# EAGLE design ww-impedance-matching (EAGLE 9.6.1)
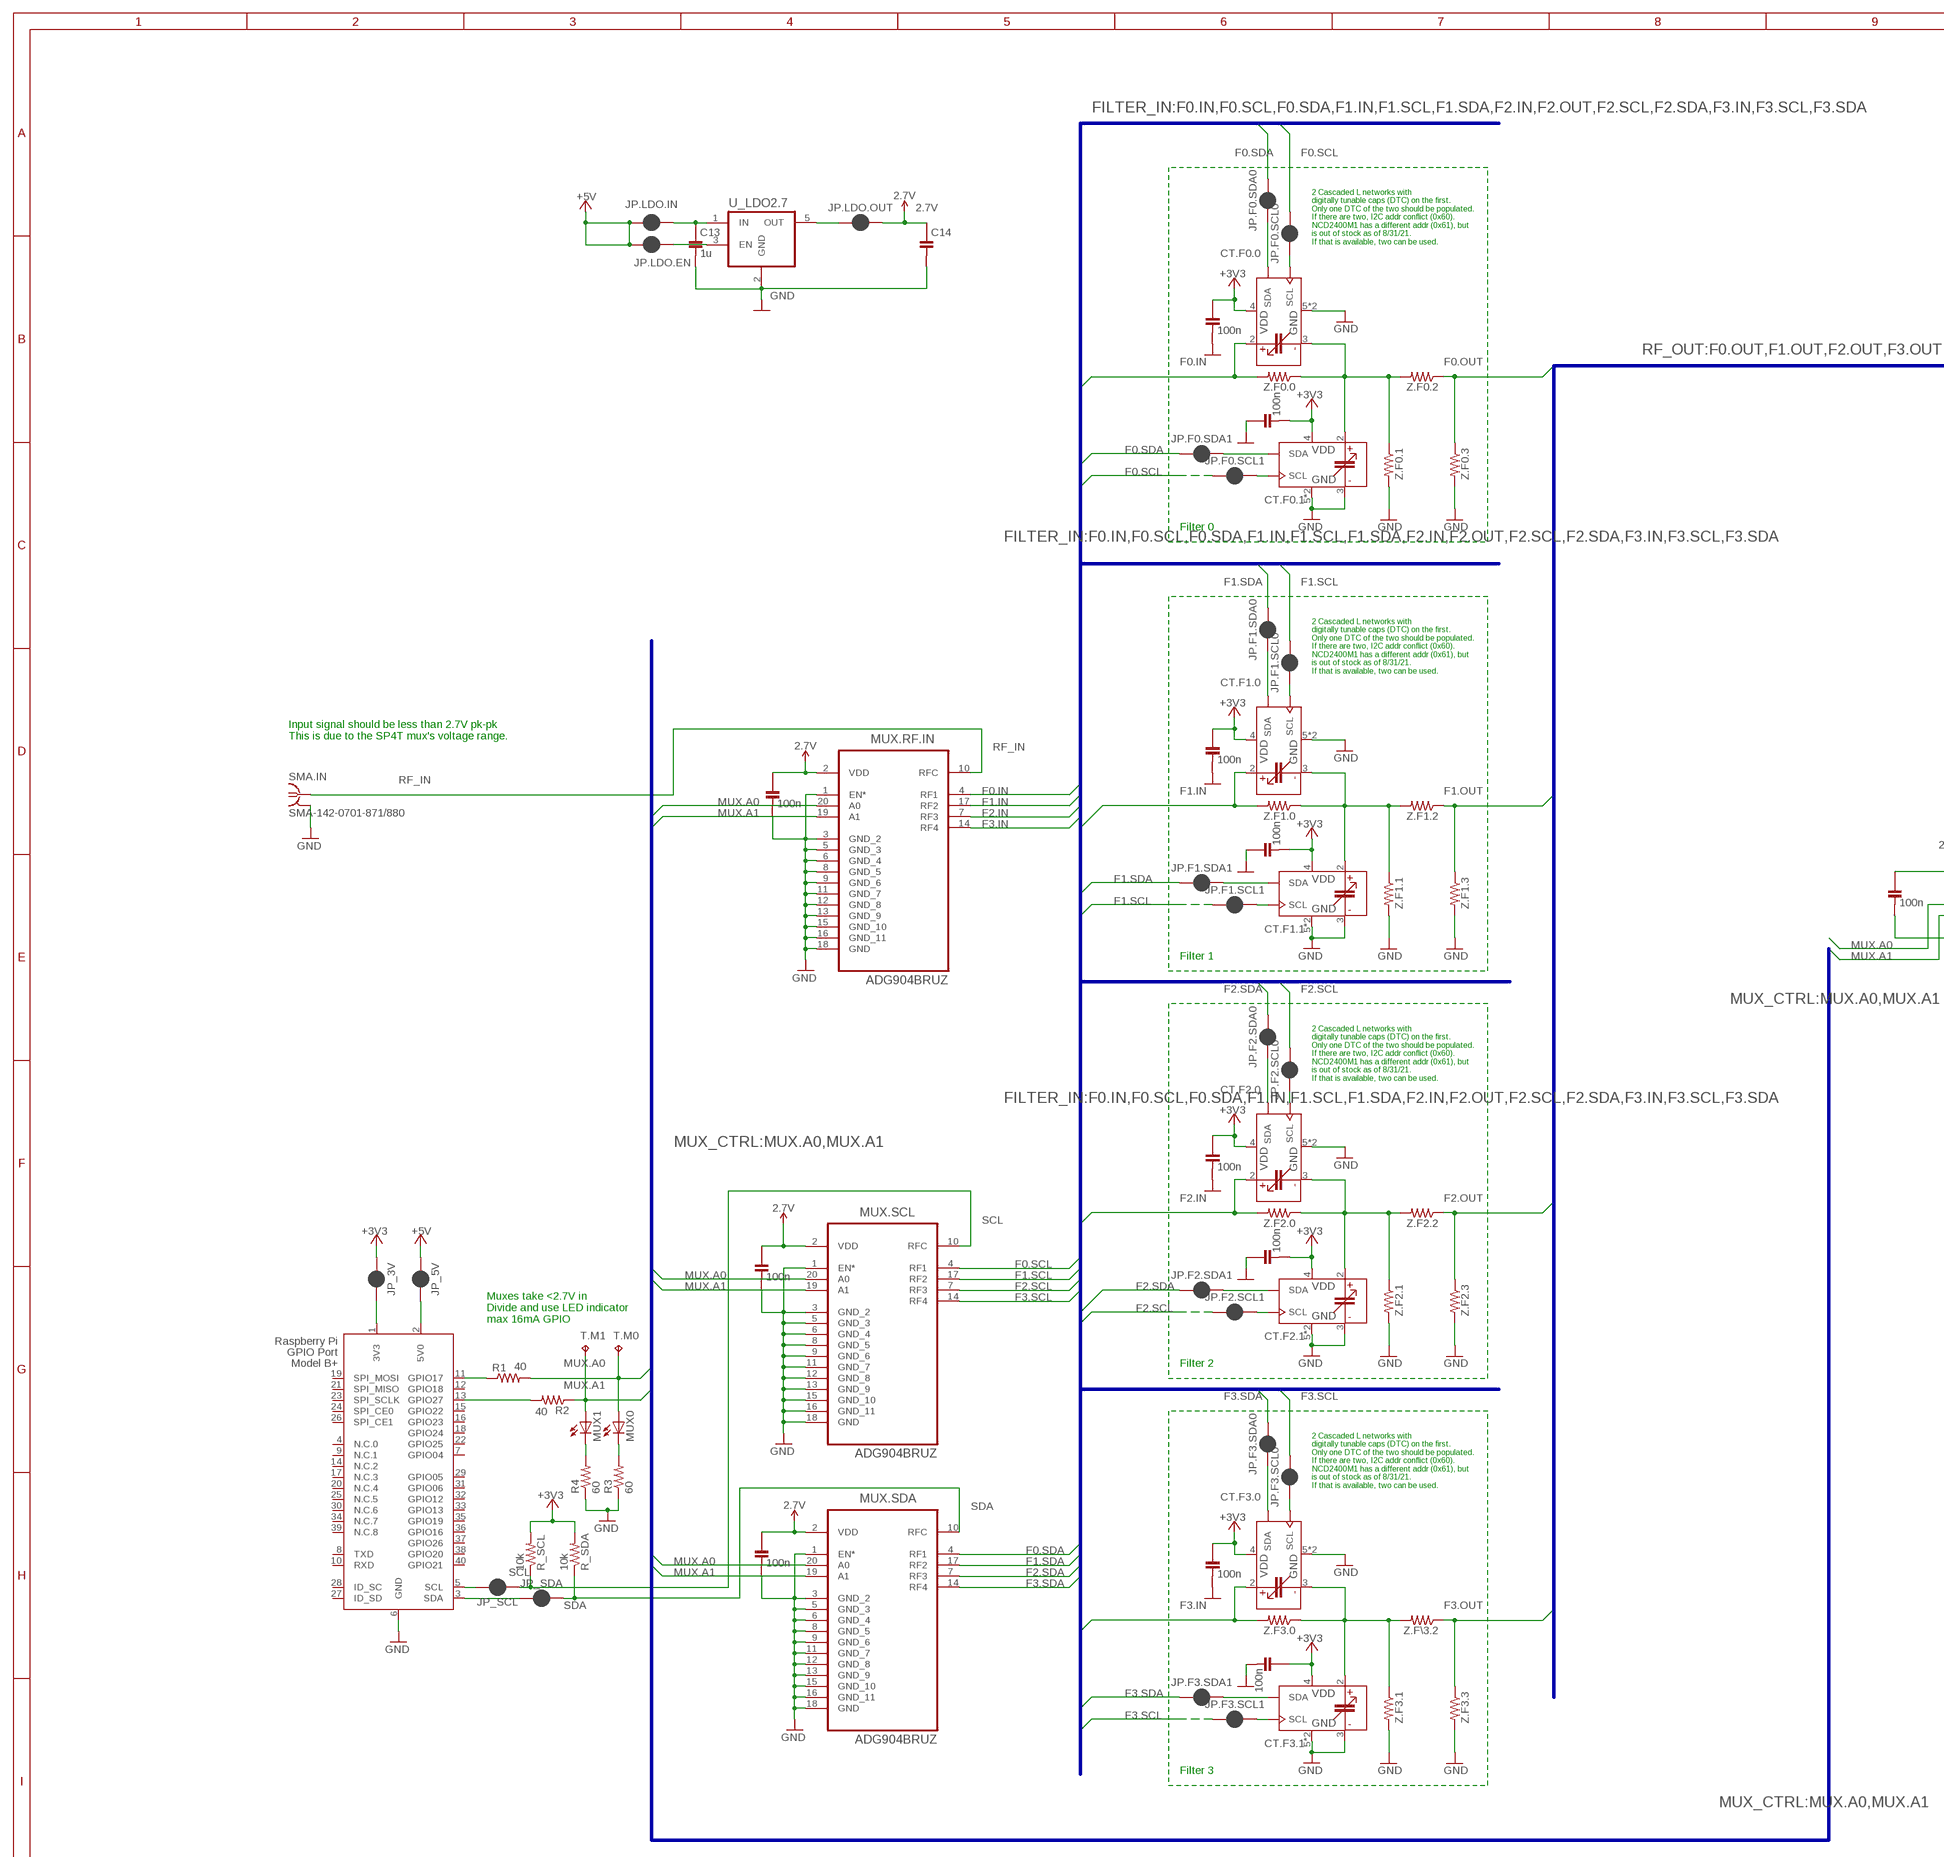
[diagram p0: schematic, sheet 1, part 1 of 2]
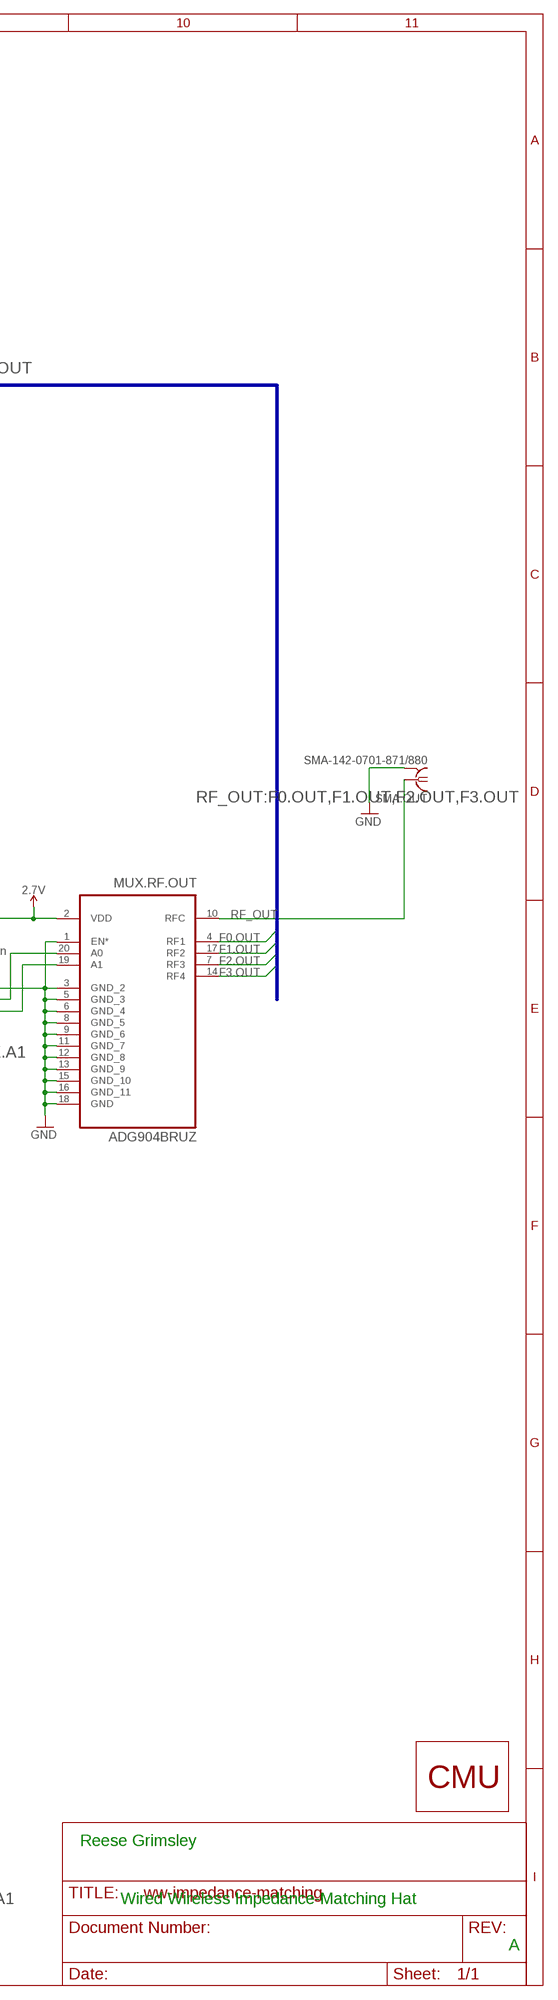
[diagram p1: schematic, sheet 1, part 2 of 2]

## Parts
C1  100n  C-0603  [C0603]
C2  100n  C-0603  [C0603]
C3  100n  C-0603  [C0603]
C4  100n  C-0603  [C0603]
C5  100n  C-0603  [C0603]
C6  100n  C-0603  [C0603]
C7  100n  C-0603  [C0603]
C8  100n  C-0603  [C0603]
C9  100n  C-0603  [C0603]
C10  100n  C-0603  [C0603]
C11  100n  C-0603  [C0603]
C12  100n  C-0603  [C0603]
C13  1u  C-0603  [C0603]
C14  C-0805  [C0805]
CT.F0.0  TUNABLE_CAP_NCD2400MTR  [DFN-6_NCD2400M]
CT.F0.1  TUNABLE_CAP_NCD2400MTR  [DFN-6_NCD2400M]
CT.F1.0  TUNABLE_CAP_NCD2400MTR  [DFN-6_NCD2400M]
CT.F1.1  TUNABLE_CAP_NCD2400MTR  [DFN-6_NCD2400M]
CT.F2.0  TUNABLE_CAP_NCD2400MTR  [DFN-6_NCD2400M]
CT.F2.1  TUNABLE_CAP_NCD2400MTR  [DFN-6_NCD2400M]
CT.F3.0  TUNABLE_CAP_NCD2400MTR  [DFN-6_NCD2400M]
CT.F3.1  TUNABLE_CAP_NCD2400MTR  [DFN-6_NCD2400M]
JP.F0.SCL0  JUMPER-SMT_2_NC_PASTE_NO-SILK  [SMT-JUMPER_2_NC_PASTE_NO-SILK]
JP.F0.SCL1  JUMPER-SMT_2_NC_PASTE_NO-SILK  [SMT-JUMPER_2_NC_PASTE_NO-SILK]
JP.F0.SDA0  JUMPER-SMT_2_NC_PASTE_NO-SILK  [SMT-JUMPER_2_NC_PASTE_NO-SILK]
JP.F0.SDA1  JUMPER-SMT_2_NC_PASTE_NO-SILK  [SMT-JUMPER_2_NC_PASTE_NO-SILK]
JP.F1.SCL0  JUMPER-SMT_2_NC_PASTE_NO-SILK  [SMT-JUMPER_2_NC_PASTE_NO-SILK]
JP.F1.SCL1  JUMPER-SMT_2_NC_PASTE_NO-SILK  [SMT-JUMPER_2_NC_PASTE_NO-SILK]
JP.F1.SDA0  JUMPER-SMT_2_NC_PASTE_NO-SILK  [SMT-JUMPER_2_NC_PASTE_NO-SILK]
JP.F1.SDA1  JUMPER-SMT_2_NC_PASTE_NO-SILK  [SMT-JUMPER_2_NC_PASTE_NO-SILK]
JP.F2.SCL0  JUMPER-SMT_2_NC_PASTE_NO-SILK  [SMT-JUMPER_2_NC_PASTE_NO-SILK]
JP.F2.SCL1  JUMPER-SMT_2_NC_PASTE_NO-SILK  [SMT-JUMPER_2_NC_PASTE_NO-SILK]
JP.F2.SDA0  JUMPER-SMT_2_NC_PASTE_NO-SILK  [SMT-JUMPER_2_NC_PASTE_NO-SILK]
JP.F2.SDA1  JUMPER-SMT_2_NC_PASTE_NO-SILK  [SMT-JUMPER_2_NC_PASTE_NO-SILK]
JP.F3.SCL0  JUMPER-SMT_2_NC_PASTE_NO-SILK  [SMT-JUMPER_2_NC_PASTE_NO-SILK]
JP.F3.SCL1  JUMPER-SMT_2_NC_PASTE_NO-SILK  [SMT-JUMPER_2_NC_PASTE_NO-SILK]
JP.F3.SDA0  JUMPER-SMT_2_NC_PASTE_NO-SILK  [SMT-JUMPER_2_NC_PASTE_NO-SILK]
JP.F3.SDA1  JUMPER-SMT_2_NC_PASTE_NO-SILK  [SMT-JUMPER_2_NC_PASTE_NO-SILK]
JP.LDO.EN  JUMPER-SMT_2_NC_PASTE_NO-SILK  [SMT-JUMPER_2_NC_PASTE_NO-SILK]
JP.LDO.IN  JUMPER-SMT_2_NC_PASTE_NO-SILK  [SMT-JUMPER_2_NC_PASTE_NO-SILK]
JP.LDO.OUT  JUMPER-SMT_2_NC_PASTE_NO-SILK  [SMT-JUMPER_2_NC_PASTE_NO-SILK]
JP_3V  JUMPER-SMT_2_NC_PASTE_NO-SILK  [SMT-JUMPER_2_NC_PASTE_NO-SILK]
JP_5V  JUMPER-SMT_2_NC_PASTE_NO-SILK  [SMT-JUMPER_2_NC_PASTE_NO-SILK]
JP_SCL  JUMPER-SMT_2_NC_PASTE_NO-SILK  [SMT-JUMPER_2_NC_PASTE_NO-SILK]
JP_SDA  JUMPER-SMT_2_NC_PASTE_NO-SILK  [SMT-JUMPER_2_NC_PASTE_NO-SILK]
LOGO1  LOGO-CMU  [CMU_LOGO]
MUX0  LEDCHIPLED_0603  [CHIPLED_0603]
MUX1  LEDCHIPLED_0603  [CHIPLED_0603]
MUX.RF.IN  ADG904BRUZ  [SOP65P640X120-20N]
MUX.RF.OUT  ADG904BRUZ  [SOP65P640X120-20N]
MUX.SCL  ADG904BRUZ  [SOP65P640X120-20N]
MUX.SDA  ADG904BRUZ  [SOP65P640X120-20N]
R1  40  R-0603  [R0603]
R2  40  R-0603  [R0603]
R3  60  R-0603  [R0603]
R4  60  R-0603  [R0603]
R_SCL  10k  R-0603  [R0603]
R_SDA  10k  R-0603  [R0603]
SMA.IN  SMA-142-0701-871/880  [SMA-142-0701-871]
SMA.OUT  SMA-142-0701-871/880  [SMA-142-0701-871]
T.M0  TPTP14R  [TP14R]
T.M1  TPTP14R  [TP14R]
U_LDO2.7  TPS76327DBVT  [SOT95P280X145-5N]
X1  RASPI_BOARD_B+_E4P  [RASPI_BOARD_B+_EDGES_4DRILL_PAD]
Z.F0.0  R-0603  [R0603]
Z.F0.1  R-0603  [R0603]
Z.F0.2  R-0603  [R0603]
Z.F0.3  R-0603  [R0603]
Z.F1.0  R-0603  [R0603]
Z.F1.1  R-0603  [R0603]
Z.F1.2  R-0603  [R0603]
Z.F1.3  R-0603  [R0603]
Z.F2.0  R-0603  [R0603]
Z.F2.1  R-0603  [R0603]
Z.F2.2  R-0603  [R0603]
Z.F2.3  R-0603  [R0603]
Z.F3.0  R-0603  [R0603]
Z.F3.1  R-0603  [R0603]
Z.F3.3  R-0603  [R0603]
Z.F\3.2  R-0603  [R0603]

## Nets
2.7V [PWR]: C7.1 C9.1 C11.1 C12.1 C14.1 JP.LDO.OUT.1 MUX.RF.IN.2(VDD) MUX.RF.OUT.2(VDD) MUX.SCL.2(VDD) MUX.SDA.2(VDD)
3V3.JMP [PWR]: JP_3V.1 X1.1(3V3)
5V.JMP [PWR]: JP_5V.1 X1.2(5V0)
+3V3 [PWR]: C1.1 C2.2 C3.1 C4.1 C5.1 C6.2 C8.1 C10.2 CT.F0.0.4(VDD) CT.F0.1.4(VDD) CT.F1.0.4(VDD) CT.F1.1.4(VDD) CT.F2.0.4(VDD) CT.F2.1.4(VDD) CT.F3.0.4(VDD) CT.F3.1.4(VDD) JP_3V.2 R_SCL.2 R_SDA.2
+5V [PWR]: JP.LDO.EN.2 JP.LDO.IN.2 JP_5V.2
F0.IN [RF]: CT.F0.0.2(C+) MUX.RF.IN.4(RF1) Z.F0.0.2
F0.OUT [RF]: MUX.RF.OUT.4(RF1) Z.F0.2.1 Z.F0.3.1
F0.SCL: JP.F0.SCL0.1 JP.F0.SCL1.2 MUX.SCL.4(RF1)
F0.SDA: JP.F0.SDA0.1 JP.F0.SDA1.2 MUX.SDA.4(RF1)
F0SCL0: CT.F0.0.6(SCL) JP.F0.SCL0.2
F0SCL1: CT.F0.1.6(SCL) JP.F0.SCL1.1
F0SDA0: CT.F0.0.1(SDA) JP.F0.SDA0.2
F0SDA1: CT.F0.1.1(SDA) JP.F0.SDA1.1
F1.IN [RF]: CT.F1.0.2(C+) MUX.RF.IN.17(RF2) Z.F1.0.2
F1.OUT [RF]: MUX.RF.OUT.17(RF2) Z.F1.2.1 Z.F1.3.1
F1.SCL: JP.F1.SCL0.1 JP.F1.SCL1.2 MUX.SCL.17(RF2)
F1.SDA: JP.F1.SDA0.1 JP.F1.SDA1.2 MUX.SDA.17(RF2)
F1SCL0: CT.F1.0.6(SCL) JP.F1.SCL0.2
F1SCL1: CT.F1.1.6(SCL) JP.F1.SCL1.1
F1SDA0: CT.F1.0.1(SDA) JP.F1.SDA0.2
F1SDA1: CT.F1.1.1(SDA) JP.F1.SDA1.1
F2.IN [RF]: CT.F2.0.2(C+) MUX.RF.IN.7(RF3) Z.F2.0.2
F2.OUT [RF]: MUX.RF.OUT.7(RF3) Z.F2.2.1 Z.F2.3.1
F2.SCL: JP.F2.SCL0.1 JP.F2.SCL1.2 MUX.SCL.7(RF3)
F2.SDA: JP.F2.SDA0.1 JP.F2.SDA1.2 MUX.SDA.7(RF3)
F2SCL0: CT.F2.0.6(SCL) JP.F2.SCL0.2
F2SCL1: CT.F2.1.6(SCL) JP.F2.SCL1.1
F2SDA0: CT.F2.0.1(SDA) JP.F2.SDA0.2
F2SDA1: CT.F2.1.1(SDA) JP.F2.SDA1.1
F3.IN [RF]: CT.F3.0.2(C+) MUX.RF.IN.14(RF4) Z.F3.0.2
F3.OUT [RF]: MUX.RF.OUT.14(RF4) Z.F3.3.1 Z.F\3.2.1
F3.SCL: JP.F3.SCL0.1 JP.F3.SCL1.2 MUX.SCL.14(RF4)
F3.SDA: JP.F3.SDA0.1 JP.F3.SDA1.2 MUX.SDA.14(RF4)
F3SCL0: CT.F3.0.6(SCL) JP.F3.SCL0.2
F3SCL1: CT.F3.1.6(SCL) JP.F3.SCL1.1
F3SDA0: CT.F3.0.1(SDA) JP.F3.SDA0.2
F3SDA1: CT.F3.1.1(SDA) JP.F3.SDA1.1
GND: C1.2 C2.1 C3.2 C4.2 C5.2 C6.1 C7.2 C8.2 C9.2 C10.1 C11.2 C12.2 C13.2 C14.2 CT.F0.0.5(GND) CT.F0.0.7(GND) CT.F0.1.3(C-) CT.F0.1.5(GND) CT.F0.1.7(GND) CT.F1.0.5(GND) CT.F1.0.7(GND) CT.F1.1.3(C-) CT.F1.1.5(GND) CT.F1.1.7(GND) CT.F2.0.5(GND) CT.F2.0.7(GND) CT.F2.1.3(C-) CT.F2.1.5(GND) CT.F2.1.7(GND) CT.F3.0.5(GND) CT.F3.0.7(GND) CT.F3.1.3(C-) CT.F3.1.5(GND) CT.F3.1.7(GND) MUX.RF.IN.1(EN*) MUX.RF.IN.3(GND_2) MUX.RF.IN.5(GND_3) MUX.RF.IN.6(GND_4) MUX.RF.IN.8(GND_5) MUX.RF.IN.9(GND_6) MUX.RF.IN.11(GND_7) MUX.RF.IN.12(GND_8) MUX.RF.IN.13(GND_9) MUX.RF.IN.15(GND_10) MUX.RF.IN.16(GND_11) MUX.RF.IN.18(GND) MUX.RF.OUT.1(EN*) MUX.RF.OUT.3(GND_2) MUX.RF.OUT.5(GND_3) MUX.RF.OUT.6(GND_4) MUX.RF.OUT.8(GND_5) MUX.RF.OUT.9(GND_6) MUX.RF.OUT.11(GND_7) MUX.RF.OUT.12(GND_8) MUX.RF.OUT.13(GND_9) MUX.RF.OUT.15(GND_10) MUX.RF.OUT.16(GND_11) MUX.RF.OUT.18(GND) MUX.SCL.1(EN*) MUX.SCL.3(GND_2) MUX.SCL.5(GND_3) MUX.SCL.6(GND_4) MUX.SCL.8(GND_5) MUX.SCL.9(GND_6) MUX.SCL.11(GND_7) MUX.SCL.12(GND_8) MUX.SCL.13(GND_9) MUX.SCL.15(GND_10) MUX.SCL.16(GND_11) MUX.SCL.18(GND) MUX.SDA.1(EN*) MUX.SDA.3(GND_2) MUX.SDA.5(GND_3) MUX.SDA.6(GND_4) MUX.SDA.8(GND_5) MUX.SDA.9(GND_6) MUX.SDA.11(GND_7) MUX.SDA.12(GND_8) MUX.SDA.13(GND_9) MUX.SDA.15(GND_10) MUX.SDA.16(GND_11) MUX.SDA.18(GND) R3.1 R4.1 SMA.IN.2@1 SMA.IN.2@2 SMA.IN.2@3 SMA.IN.2@4 SMA.OUT.2@1 SMA.OUT.2@2 SMA.OUT.2@3 SMA.OUT.2@4 U_LDO2.7.2(GND) X1.6(GND) Z.F0.1.2 Z.F0.3.2 Z.F1.1.2 Z.F1.3.2 Z.F2.1.2 Z.F2.3.2 Z.F3.1.2 Z.F3.3.2
LDO.IN: C13.1 JP.LDO.IN.1 U_LDO2.7.1(IN)
LDO.OUT [PWR]: JP.LDO.OUT.2 U_LDO2.7.5(OUT)
MUX.A0: MUX0.A MUX.RF.IN.20(A0) MUX.RF.OUT.20(A0) MUX.SCL.20(A0) MUX.SDA.20(A0) R1.2 T.M0.TP
MUX.A1: MUX1.A MUX.RF.IN.19(A1) MUX.RF.OUT.19(A1) MUX.SCL.19(A1) MUX.SDA.19(A1) R2.1 T.M1.TP
N$6: MUX1.C R4.2
N$9: JP.LDO.EN.1 U_LDO2.7.3(EN)
N$10: MUX0.C R3.2
N$11: R2.2 X1.13(GPIO27)
N$12: R1.1 X1.11(GPIO17)
RF.F0.0 [RF]: CT.F0.0.3(C-) CT.F0.1.2(C+) Z.F0.0.1 Z.F0.1.1 Z.F0.2.2
RF.F1.0 [RF]: CT.F1.0.3(C-) CT.F1.1.2(C+) Z.F1.0.1 Z.F1.1.1 Z.F1.2.2
RF.F2.0 [RF]: CT.F2.0.3(C-) CT.F2.1.2(C+) Z.F2.0.1 Z.F2.1.1 Z.F2.2.2
RF.F3.0 [RF]: CT.F3.0.3(C-) CT.F3.1.2(C+) Z.F3.0.1 Z.F3.1.1 Z.F\3.2.2
RF_IN [RF]: MUX.RF.IN.10(RFC) SMA.IN.1
RF_OUT [RF]: MUX.RF.OUT.10(RFC) SMA.OUT.1
SCL: JP_SCL.2 MUX.SCL.10(RFC) R_SCL.1
SCL.IN: JP_SCL.1 X1.5(SCL)
SDA: JP_SDA.1 MUX.SDA.10(RFC) R_SDA.1
SDA.IN: JP_SDA.2 X1.3(SDA)
Unconnected: X1.4(N.C.0) X1.7(GPIO04) X1.8(TXD) X1.9(N.C.1) X1.10(RXD) X1.12(GPIO18) X1.14(N.C.2) X1.15(GPIO22) X1.16(GPIO23) X1.17(N.C.3) X1.18(GPIO24) X1.19(SPI_MOSI) X1.20(N.C.4) X1.21(SPI_MISO) X1.22(GPIO25) X1.23(SPI_SCLK) X1.24(SPI_CE0) X1.25(N.C.5) X1.26(SPI_CE1) X1.27(ID_SD) X1.28(ID_SC) X1.29(GPIO05) X1.30(N.C.6) X1.31(GPIO06) X1.32(GPIO12) X1.33(GPIO13) X1.34(N.C.7) X1.35(GPIO19) X1.36(GPIO16) X1.37(GPIO26) X1.38(GPIO20) X1.39(N.C.8) X1.40(GPIO21)

## Buses
FILTER_IN:F0.IN,F0.SCL,F0.SDA,F1.IN,F1.SCL,F1.SDA,F2.IN,F2.OUT,F2.SCL,F2.SDA,F3.IN,F3.SCL,F3.SDA
MUX_CTRL:MUX.A0,MUX.A1
RF_OUT:F0.OUT,F1.OUT,F2.OUT,F3.OUT

## Notes on the sheet
- 2 Cascaded L networks with 
  digitally tunable caps (DTC) on the first. 
  Only one DTC of the two should be populated. 
  If there are two, I2C addr conflict (0x60).
  NCD2400M1 has a different addr (0x61), but
  is out of stock as of 8/31/21. 
  If that is available, two can be used.
- Filter 0
- 2 Cascaded L networks with 
  digitally tunable caps (DTC) on the first. 
  Only one DTC of the two should be populated. 
  If there are two, I2C addr conflict (0x60).
  NCD2400M1 has a different addr (0x61), but
  is out of stock as of 8/31/21. 
  If that is available, two can be used.
- Input signal should be less than 2.7V pk-pk
  This is due to the SP4T mux's voltage range.
- Filter 1
- 2 Cascaded L networks with 
  digitally tunable caps (DTC) on the first. 
  Only one DTC of the two should be populated. 
  If there are two, I2C addr conflict (0x60).
  NCD2400M1 has a different addr (0x61), but
  is out of stock as of 8/31/21. 
  If that is available, two can be used.
- Muxes take <2.7V in
  Divide and use LED indicator
  max 16mA GPIO
- Filter 2
- 2 Cascaded L networks with 
  digitally tunable caps (DTC) on the first. 
  Only one DTC of the two should be populated. 
  If there are two, I2C addr conflict (0x60).
  NCD2400M1 has a different addr (0x61), but
  is out of stock as of 8/31/21. 
  If that is available, two can be used.
- Reese Grimsley
- Filter 3
- Wired Wireless Impedance-Matching Hat
- A

## Library data of the parts
C1-C12 = Capacitors:C-: Capacitor, Surface Mount; MANUFACTURER: YAGEO; MP: CC0603MRX7R7BB104; MPN: CC0603MRX7R7BB104; PART_NO: CC0603MRX7R7BB104; TC: X7R; TOL: 10%; VOLTAGE: 6.3V
C13 = Capacitors:C-: Capacitor, Surface Mount; MANUFACTURER: Kemet; MP: CC0603MRX5R8BB105; MPN: CC0603MRX5R8BB105; PART_NO: CC0603MRX5R8BB105; TC: X7R; TOL: 10%; VOLTAGE: 6.3V
C14 = Capacitors:C-: Capacitor, Surface Mount; MANUFACTURER: Kemet; MP: CC0805KPX5R6BB106; MPN: CC0805KPX5R6BB106; PART_NO: CC0805KPX5R6BB106; TC: X7R; TOL: 10%; VOLTAGE: 6.3V
CT.F0.0 CT.F0.1 CT.F1.0 CT.F1.1 CT.F2.0 CT.F2.1 CT.F3.0 CT.F3.1 = Capacitors:TUNABLE_CAP_NCD2400MTR: Digitally Tunable Capacitor NCD2400M from IXYS; MP: NCD2400M; MPN: NCD2400M; PART_NO: NCD2400M
JP.F0.SCL0 JP.F0.SCL1 JP.F0.SDA0 JP.F0.SDA1 JP.F1.SCL0 JP.F1.SCL1 JP.F1.SDA0 JP.F1.SDA1 JP.F2.SCL0 JP.F2.SCL1 JP.F2.SDA0 JP.F2.SDA1 JP.F3.SCL0 JP.F3.SCL1 JP.F3.SDA0 JP.F3.SDA1 JP.LDO.EN JP.LDO.IN JP.LDO.OUT JP_3V JP_5V JP_SCL JP_SDA = Connectors:JUMPER-SMT_2_NC_PASTE: Normally closed solder jumper This jumper has an aperture in the stencil to allow solder paste to bridge the split in the wire so it's normally closed (NC). Wick off the solder to open the connection. Reapply solder to reclose the connection.; BOM: EXCLUDE
LOGO1 = Graphics:LOGO-CMU: CMU silkscreen logo
MUX0 MUX1 = Diodes:LED: LED OSRAM: - CHIPLED LG R971, LG N971, LY N971, LG Q971, LY Q971, LO R971, LY R971 LH N974, LH R974 LS Q976, LO Q976, LY Q976 LO Q996 - Hyper CHIPLED LW Q18S LB Q993, LB Q99A, LB R99A - SideLED LS A670, LO A670, LY A670, LG A670, LP A670 LB A673, LV A673, LT A673, LW A673 LH A674 LY A675 LS A676, LA A676, LO A676, LY A676, LW A676 LS A679, LY A679, LG A679 - Hyper Micro SIDELED® LS Y876, LA Y876, LO Y876, LY Y876 LT Y87S - SmartLED LW L88C, LW L88S LB L89C, LB L89S, LG L890 LS L89K, LO L89K, LY L89K LS L896, LA L896, LO L896, LY L896 - TOPLED LS T670, LO T670, LY T670, LG T670, LP T670 LSG T670, LSP T670, LSY T670, LOP T670, LYG T670 LG T671, LOG T671, LSG T671 LB T673, LV T673, LT T673, LW T673 LH T674 LS T676, LA T676, LO T676, LY T676, LB T676, LH T676, LSB T676, LW T676 LB T67C, LV T67C, LT T67C, LS T67K, LO T67K, LY T67K, LW E67C LS E67B, LA E67B, LO E67B, LY E67B, LB E67C, LV E67C, LT E67C LW T67C LS T679, LY T679, LG T679 LS T770, LO T770, LY T770, LG T770, LP T770 LB T773, LV T773, LT T773, LW T773 LH T774 LS E675, LA E675, LY E675, LS T675 LS T776, LA T776, LO T776, LY T776, LB T776 LHGB T686 LT T68C, LB T68C - Hyper Mini TOPLED® LB M676 - Mini TOPLED Santana® LG M470 LS M47K, LO M47K, LY M47K Source: http://www.osram.convergy.de/; MP: LSM0603412V; MPN: LSM0603412V; PART_NO: LSM0603412V
MUX.RF.IN MUX.RF.OUT MUX.SCL MUX.SDA = Switches:ADG904BRUZ: Analog MULTIPLEXER, 4X1, 20TSSOP Check prices <https://pricing.snapeda.com/parts/ADG904BRUZ/Analog%20Devices/view-part?ref=eda>; AVAILABILITY: In Stock; DESCRIPTION: 1 Circuit IC Switch 4:1 20-TSSOP; MF: Analog Devices; MP: ADG904BRUZ; PACKAGE: TSSOP-20 Analog Devices; PRICE: None; PURCHASE-URL: https://pricing.snapeda.com/search/part/ADG904BRUZ/?ref=eda
R1 R2 = Resistors:R-: Resistor, Surface Mount; MANUFACTURER: Panasonic; MP: ERJ-3EKF40R2V; MPN: ERJ-3EKF40R2V; PART_NO: ERJ-3EKF40R2V; TOL: 5%
R3 R4 = Resistors:R-: Resistor, Surface Mount; MANUFACTURER: Panasonic; MP: ERJ-3EKF60R4V; MPN: ERJ-3EKF60R4V; PART_NO: ERJ-3EKF60R4V; TOL: 5%
R_SCL R_SDA = Resistors:R-: Resistor, Surface Mount; MANUFACTURER: Panasonic; MP: ERJ-PA3F1002V; MPN: ERJ-PA3F1002V; PART_NO: ERJ-PA3F1002V; TOL: 5%
SMA.IN SMA.OUT = con-coax:SMA-: SMA 50 Ohm End Launch Jack Receptacle - Round Contact Johnson Components Source: www.johnsoncomponents.com .. J502-ND.pdf; MF: JOHNSON COMPONENTS; MP: 142-0701-871; MPN: 142-0701-871; OC_FARNELL: 1339835; OC_NEWARK: 91B6105; PART_NO: 142-0701-871
T.M0 T.M1 = TestPoints:TP: Test pad
U_LDO2.7 = Regulators:TPS76327DBVT: Check prices <https://pricing.snapeda.com/parts/TPS76327DBVT/Texas%20Instruments/view-part?ref=eda>; AVAILABILITY: In Stock; DESCRIPTION: 150-mA, 10-V, low-dropout voltage regulator with enable 5-SOT-23 -40 to 125; MF: Texas Instruments; MP: TPS76327DBVT; MPN: TPS76327DBVT; PACKAGE: SOT-23-5 Texas Instruments; PRICE: None; PURCHASE-URL: https://pricing.snapeda.com/search/part/TPS76327DBVT/?ref=eda
X1 = raspberrypi_bastelstube_v13:RASPI_BOARD_B+: Raspberry Pi GPIO connector with markings for the outer dimensions of the Raspberry Pi board model B+ with different sets of drill holes or mounting pads; MP: TSM-110-02-S-DV; MPN: TSM-110-02-S-DV; PART_NO: TSM-110-02-S-DV
Z.F0.0 Z.F0.1-Z.F0.3 Z.F1.0 Z.F1.1-Z.F1.3 Z.F2.0 Z.F2.1-Z.F2.3 Z.F3.0 Z.F3.1 Z.F3.3 Z.F\3.2 = Resistors:R-: Resistor, Surface Mount; MANUFACTURER: Panasonic; TOL: 5%

## Net classes
0 default: width 0.152 mm
1 PWR: width 0.305 mm
2 RF: width 0.254 mm, clearance 0.203 mm

## Board
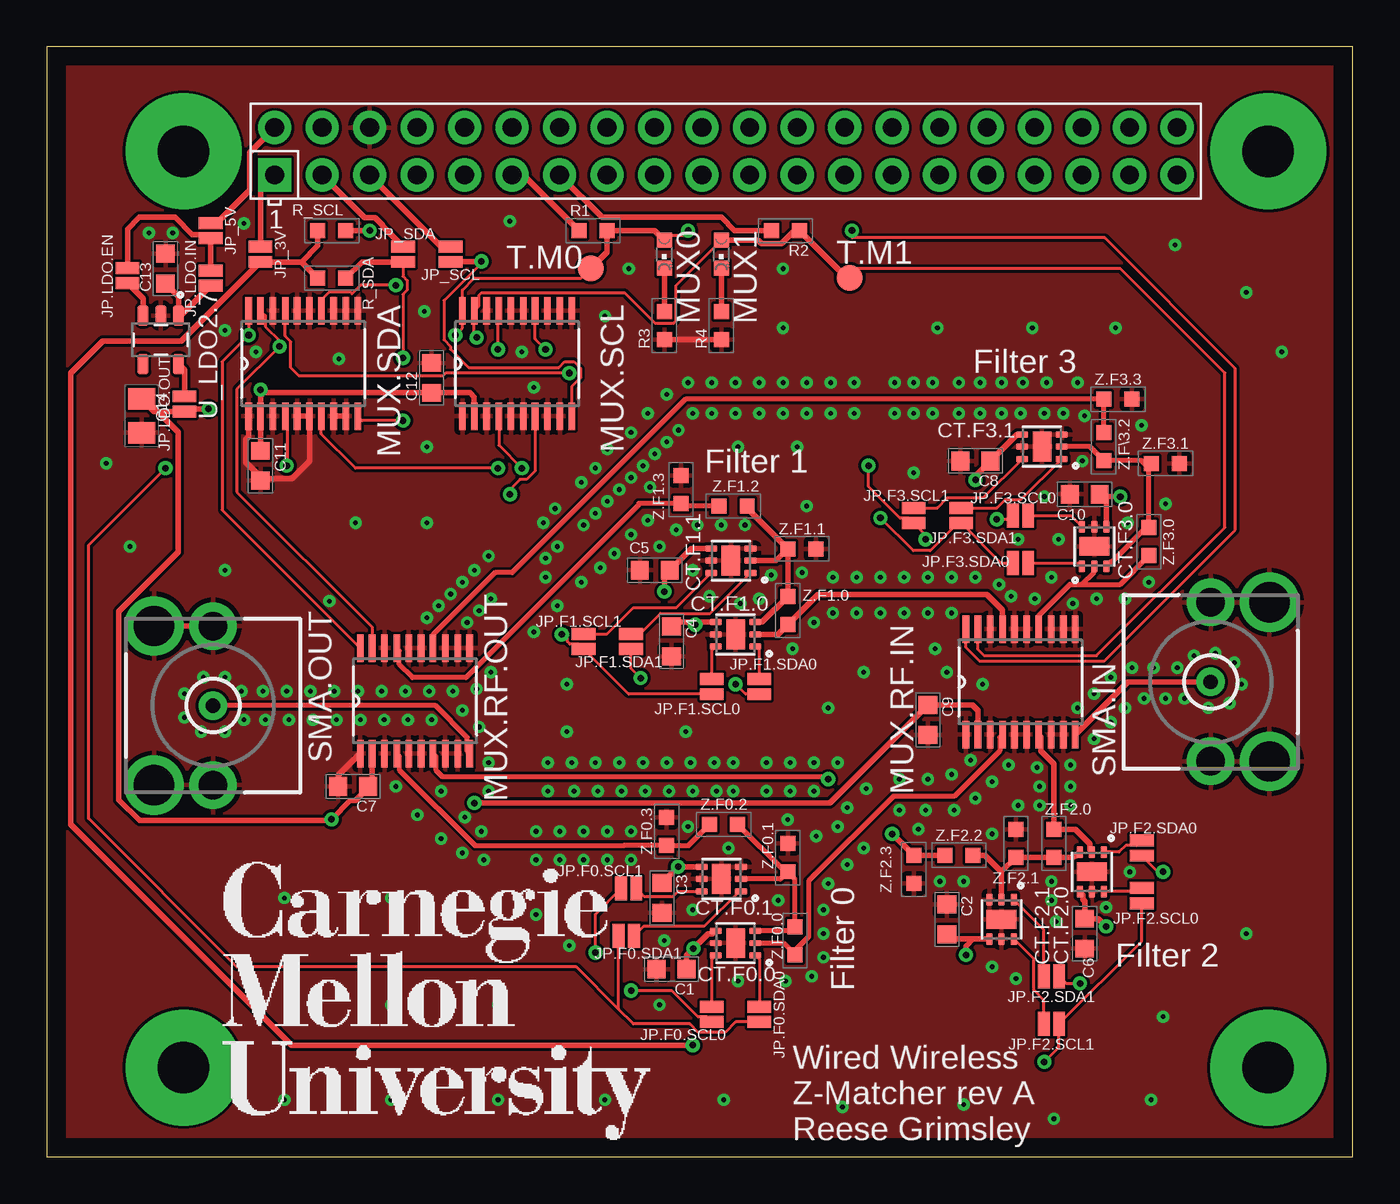
[diagram p2: board, top side]
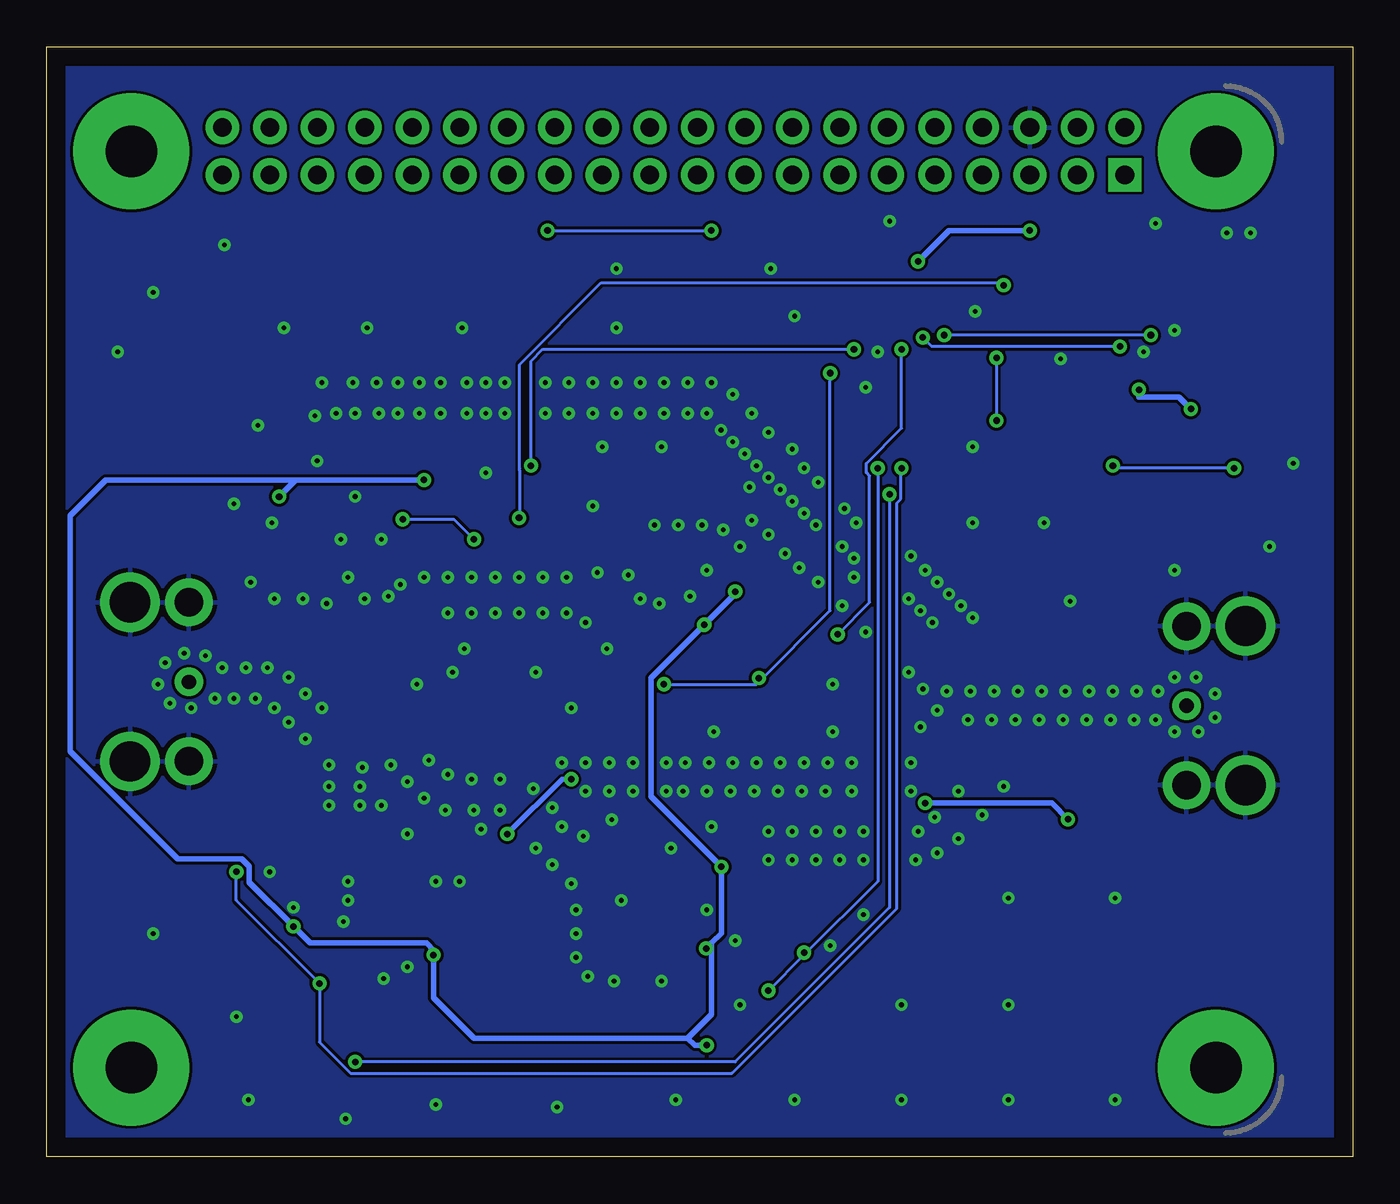
[diagram p3: board, bottom side, seen from below]

Size 69.83 x 59.36 mm. Coordinates in mm from the lower left corner, seen from the top.
Outline: 0,0 69.83,0 69.83,59.36 0,59.36 0,0
Copper layers (1*16): Top 0.034796875mm / dielectric 57mil / Bottom 0.034796875mm
Design rules "default *": minimum track width 6mil, minimum drill 0.2mm, track to track 6mil, track to pad 6mil, pad to pad 6mil, via to via 6mil, smd to smd 6mil, copper to edge 40mil, drill to drill 6mil, minimum pad ring 8mil, minimum via ring 8mil, stop-mask expansion 4mil, vias tented up to drill 0mil, thermal gap 10mil

### Footprints (pad centres in the part's own frame; a part is rotated, then mirrored left to right if it is on the bottom)
C0603 = smd 0.95 x 1: 1 -0.8,0; 2 0.8,0
C0805 = smd 1.15 x 1.45: 1 -0.9,0; 2 0.9,0
DFN-6_NCD2400M = smd 0.66 x 0.356: 1 -1.054,0.65; 2 -1.054,0; 3 -1.054,-0.65; 4 1.054,-0.65; 5 1.054,0; 6 1.054,0.65 | smd 0.991 x 1.6: 7 0,0
SMT-JUMPER_2_NC_PASTE_NO-SILK = smd 0.635 x 1.27: 1 -0.406,0; 2 0.406,0
CHIPLED_0603 = smd 0.8 x 0.8: A 0,-0.75; C 0,0.75
SOP65P640X120-20N = smd 1.473 x 0.356: 1 -2.819,2.921; 2 -2.819,2.286; 3 -2.819,1.626; 4 -2.819,0.965; 5 -2.819,0.33; 6 -2.819,-0.33; 7 -2.819,-0.965; 8 -2.819,-1.626; 9 -2.819,-2.286; 10 -2.819,-2.921; 11 2.819,-2.921; 12 2.819,-2.286; 13 2.819,-1.626; 14 2.819,-0.965; 15 2.819,-0.33; 16 2.819,0.33; 17 2.819,0.965; 18 2.819,1.626; 19 2.819,2.286; 20 2.819,2.921
R0603 = smd 0.8 x 0.8: 1 -0.75,0; 2 0.75,0
SMA-142-0701-871 = drill 0.762 pad 1.524: 1 0,0 | drill 1.524 pad 2.54: 2@1 -4.255,0; 2@2 4.255,0 | drill 2.159 pad 2.794: 2@3 -4.255,-3.15; 2@4 4.255,-3.15
TP14R = smd 1.4 x 1.4: TP 0,0
SOT95P280X145-5N = smd 1.1 x 0.59: 1 -1.3,0.95; 2 -1.3,0; 3 -1.3,-0.95; 4 1.3,-0.95; 5 1.3,0.95
RASPI_BOARD_B+_EDGES_4DRILL_PAD = drill 1 pad 1.778 square: 1 8.37,51.23 | drill 1 pad 1.778: 2 8.37,53.77; 3 10.91,51.23; 4 10.91,53.77; 5 13.45,51.23; 6 13.45,53.77; 7 15.99,51.23; 8 15.99,53.77; 9 18.53,51.23; 10 18.53,53.77; 11 21.07,51.23; 12 21.07,53.77; 13 23.61,51.23; 14 23.61,53.77; 15 26.15,51.23; 16 26.15,53.77; 17 28.69,51.23; 18 28.69,53.77; 19 31.23,51.23; 20 31.23,53.77; 21 33.77,51.23; 22 33.77,53.77; 23 36.31,51.23; 24 36.31,53.77; 25 38.85,51.23; 26 38.85,53.77; 27 41.39,51.23; 28 41.39,53.77; 29 43.93,51.23; 30 43.93,53.77; 31 46.47,51.23; 32 46.47,53.77; 33 49.01,51.23; 34 49.01,53.77; 35 51.55,51.23; 36 51.55,53.77; 37 54.09,51.23; 38 54.09,53.77; 39 56.63,51.23; 40 56.63,53.77 | drill 2.75 pad 6.2: 41 3.5,3.5; 42 61.5,3.5; 43 61.5,52.5; 44 3.5,52.5

### Placement (x,y rotation side)
C1  33.4,10.03 180 top
C2  48.13,12.7 270 top
C3  32.89,13.84 270 top
C4  33.4,27.56 270 top
C5  32.51,31.37 180 top
C6  55.5,11.94 90 top
C7  16.38,19.81 180 top
C8  49.66,37.21 180 top
C9  47.12,23.37 270 top
C10  55.5,35.43 0 top
C11  11.43,36.96 270 top
C12  20.57,41.66 90 top
C13  6.35,47.5 90 top
C14  5.08,39.62 270 top
CT.F0.0  36.83,11.43 180 top
CT.F0.1  36.07,14.86 180 top
CT.F1.0  36.83,27.94 180 top
CT.F1.1  36.58,31.88 180 top
CT.F2.0  55.88,15.24 270 top
CT.F2.1  51.05,12.7 270 top
CT.F3.0  56.01,32.64 90 top
CT.F3.1  53.21,37.97 180 top
JP.F0.SCL0  35.56,7.62 90 top
JP.F0.SCL1  31.11,14.35 180 top
JP.F0.SDA0  38.1,7.62 90 top
JP.F0.SDA1  30.99,11.81 180 top
JP.F1.SCL0  35.56,25.15 90 top
JP.F1.SCL1  28.7,27.56 270 top
JP.F1.SDA0  38.1,25.15 90 top
JP.F1.SDA1  31.24,27.56 270 top
JP.F2.SCL0  58.55,13.97 90 top
JP.F2.SCL1  53.72,7.11 0 top
JP.F2.SDA0  58.55,16.51 90 top
JP.F2.SDA1  53.72,9.65 0 top
JP.F3.SCL0  52.07,34.29 0 top
JP.F3.SCL1  46.35,34.29 270 top
JP.F3.SDA0  52.07,31.75 0 top
JP.F3.SDA1  48.9,34.29 270 top
JP.LDO.EN  4.32,47.12 90 top
JP.LDO.IN  8.76,46.99 90 top
JP.LDO.OUT  7.37,40.26 90 top
JP_3V  11.43,48.26 270 top
JP_5V  8.76,49.53 270 top
JP_SCL  21.59,48.26 270 top
JP_SDA  19.05,48.26 90 top
LOGO1  9.53,15.88 0 top
MUX0  33.02,48.26 180 top
MUX1  36.07,48.26 180 top
MUX.RF.IN  52.07,25.4 90 top
MUX.RF.OUT  19.68,24.38 90 top
MUX.SCL  25.15,42.42 90 top
MUX.SDA  13.72,42.42 90 top
R1  29.21,49.53 0 top
R2  39.5,49.53 180 top
R3  33.02,44.45 90 top
R4  36.07,44.45 90 top
R_SCL  15.24,49.53 180 top
R_SDA  15.24,46.99 180 top
SMA.IN  62.23,25.4 90 top
SMA.OUT  8.89,24.13 270 top
T.M0  29.08,47.5 0 top
T.M1  42.93,46.99 0 top
U_LDO2.7  6.1,43.69 270 top
X1  3.81,1.27 0 top
Z.F0.0  40.01,11.56 270 top
Z.F0.1  39.62,16 90 top
Z.F0.2  36.2,17.78 0 top
Z.F0.3  33.15,17.4 90 top
Z.F1.0  39.62,29.21 270 top
Z.F1.1  40.39,32.51 0 top
Z.F1.2  36.7,34.8 0 top
Z.F1.3  33.91,35.69 90 top
Z.F2.0  53.85,16.76 90 top
Z.F2.1  51.82,16.76 90 top
Z.F2.2  48.77,16.13 0 top
Z.F2.3  46.35,15.37 270 top
Z.F3.0  58.93,32.89 270 top
Z.F3.1  59.82,37.08 0 top
Z.F3.3  57.28,40.51 0 top
Z.F\3.2  56.52,37.97 270 top

### Tracks (layer width: path | path; a pad name or v marks a point on that pad's centre or on a via)
2.7V  (via drill 0.35)
  Top 0.305: MUX.SCL.2 22.86,40.64 22.64,40.86 C12.1 11.6,40.86 | MUX.RF.IN.2 49.78,23.88 49.49,24.17 C9.1 41.87,18.92 v22.86,18.92 | C7.1 17.4,20.03 | 17.4,20.03 MUX.RF.OUT.2 | v8.65,39.99 7.5,39.99 JP.LDO.OUT.1 5.75,39.85 C14.1 5.26,40.52 7.03,38.76 7.03,32.35 3.85,29.17 3.85,19.09 4.96,17.98 15.16,17.98 v15.23,18.05 16.23,19.05 16.51,19.05 17.4,19.94 17.4,20.03 | 11.6,40.86 v11.43,41.02 | C11.1 MUX.SDA.2 11.43,40.69 11.6,40.86
  Bottom 0.305: v8.65,39.99 9.3,40.64 11.43,40.64 v11.43,41.02 | v22.86,18.92 16.1,18.92 v15.23,18.05
3V3.JMP
  Top 0.305: X1.1 11.43,51.75 JP_3V.1
5V.JMP
  Top 0.305: JP_5V.1 9.08,49.94 10.84,51.7 10.84,53.7 X1.2
+3V3  (via drill 0.35)
  Top 0.305: 13.63,47.85 JP_3V.2 11.42,47.85 7.19,43.62 2.98,43.62 1.27,41.91 1.27,17.78 13.08,5.97 v34.54,5.97 | R_SDA.2 13.63,47.85 | 13.63,47.85 14.49,48.72 R_SCL.2 | C2.2 48.39,11.65 49.53,11.65 | 49.53,11.65 CT.F2.1.4 | CT.F2.0.4 55.4,14.02 55.4,13.76 55.5,13.65 C6.2 56.22,12.74 v56.64,12.32 | CT.F3.0.4 56.66,35.08 C10.2 56.43,35.31 v57.4,35.31 | CT.F3.1.4 51.87,38.62 C8.1 49.66,36.41 v49.66,36.2 | CT.F1.0.4 34.29,28.59 | 34.29,28.59 33.63,28.59 C4.1 | CT.F1.1.4 34.47,32.53 C5.1 33.02,31.08 v33.02,30.23 | C3.1 v33.76,15.51 CT.F0.1.4 | CT.F0.0.4 35.61,11.91 35.34,11.91 v34.58,11.14 34.2,10.77 C1.1 | v49.15,10.79 49.15,11.27 49.53,11.65 | 34.29,28.59 34.42,28.46 v34.67,28.46
  Bottom 0.305: v34.58,11.14 34.29,11.43 | 34.29,11.43 33.76,11.96 v33.76,15.51 37.51,19.26 37.51,25.61 v34.67,28.46 33.02,30.11 v33.02,30.23 | 34.29,11.43 34.29,7.62 35.56,6.35 | 35.56,6.35 46.99,6.35 49.15,8.51 v49.15,10.79 49.15,11.05 49.53,11.43 55.75,11.43 v56.64,12.32 59.01,14.68 59.01,15.52 59.41,15.92 62.83,15.92 68.58,21.67 68.58,34.29 66.67,36.2 56.52,36.2 | 35.56,6.35 35.18,5.97 v34.54,5.97 | v49.66,36.2 56.52,36.2 | 56.52,36.2 v57.4,35.31
+5V
  Top 0.305: 4.34,47.52 JP.LDO.EN.2 4.32,49.6 4.95,50.24 6.86,50.24 7.78,49.31 8.57,49.31 JP_5V.2 JP.LDO.IN.2
F0.IN
  Top 0.254: MUX.RF.IN.4 50.95,22.43 50.95,21.71 48.52,19.28 45.27,19.28 40.73,14.75 40.73,11.77 40.01,11.04 Z.F0.0.2 39.38,11.43 CT.F0.0.2
F0.OUT
  Top 0.254: Z.F0.2.1 34.31,16.65 Z.F0.3.1 31.75,16.65 30.85,16.65 22.89,16.65 18.85,20.69 18.85,21.44 MUX.RF.OUT.4
F0.SCL  (via drill 0.35)
  Top 0.152: JP.F0.SCL0.1 35.29,7.48 34.83,7.48 33.42,8.89 v31.24,8.89 | v29.34,10.92 29.34,12.98 JP.F0.SCL1.2 | MUX.SCL.4 24.18,38.05 v25.4,36.83
  Bottom 0.152: v31.24,8.89 29.34,10.79 | 29.34,10.79 v29.34,10.92 | v25.4,36.83 25.4,14.73 29.34,10.79
F0.SDA  (via drill 0.35)
  Top 0.152: JP.F0.SDA0.1 36.84,7.21 36.29,6.67 34.83,6.67 34.39,7.11 31.37,7.11 30.58,7.9 | 30.58,7.9 JP.F0.SDA1.2 | 30.58,7.9 28.32,10.16 10.16,10.16 2.23,18.09 2.23,32.72 v6.35,36.83 | MUX.SDA.4 12.85,39.5 12.85,36.98 v12.83,36.96
  Bottom 0.152: v12.83,36.96 12.7,36.83 v6.35,36.83
F0SCL0
  Top 0.152: JP.F0.SCL0.2 35.56,10.56 CT.F0.0.6
F0SCL1
  Top 0.152: CT.F0.1.6 33.76,14.21 33.49,13.94 31.93,13.94 JP.F0.SCL1.1
F0SDA0
  Top 0.152: CT.F0.0.1 38.1,10.56 JP.F0.SDA0.2
F0SDA1
  Top 0.152: JP.F0.SDA1.1 31.92,12.34 35.17,12.34 37.04,14.21 CT.F0.1.1
F1.IN
  Top 0.305: CT.F1.0.2 39.1,27.94 Z.F1.0.2 41.24,30.07 50.26,30.07 51.1,29.23 MUX.RF.IN.17
F1.OUT
  Top 0.254: Z.F1.2.1 34.05,34.8 Z.F1.3.1 31.65,34.94 31.65,34.87 22.41,25.63 19.55,25.63 18.85,26.33 18.85,27.08 MUX.RF.OUT.17
F1.SCL  (via drill 0.35)
  Top 0.152: JP.F1.SCL0.1 31.11,24.74 JP.F1.SCL1.2 28.43,27.42 27.97,27.42 27.84,27.55 27.84,27.94 v27.54,27.94 | v24.13,43.18 24.13,45.19 MUX.SCL.17
  Bottom 0.152: v27.54,27.94 25.83,29.64 25.83,36.41 26.01,36.58 26.01,37.08 24.13,38.96 v24.13,43.18
F1.SDA  (via drill 0.35)
  Top 0.152: JP.F1.SDA0.1 37.36,24.74 v36.83,25.27 | v31.75,25.6 31.24,26.11 JP.F1.SDA1.2 | v27.94,41.91 21.33,41.91 21.17,41.75 13.49,41.75 13.05,42.19 13.05,43.59 12.75,43.89 MUX.SDA.17
  Bottom 0.152: v36.83,25.27 31.88,25.27 31.75,25.4 | 31.75,25.4 v31.75,25.6 | 31.75,25.4 27.94,29.21 v27.94,41.91
F1SCL0
  Top 0.152: JP.F1.SCL0.2 35.56,27.07 CT.F1.0.6
F1SCL1
  Top 0.152: CT.F1.1.6 33.9,29.6 33.66,29.37 31.37,29.37 29.97,27.96 JP.F1.SCL1.1
F1SDA0
  Top 0.152: JP.F1.SDA0.2 38.1,27.07 CT.F1.0.1
F1SDA1
  Top 0.152: JP.F1.SDA1.1 31.71,27.96 32.81,29.06 35.47,29.06 CT.F1.1.1
F2.IN
  Top 0.305: MUX.RF.IN.7 53.16,22.45 53.16,21.7 53.85,21.01 Z.F2.0.2 54.99,17.51 55.76,16.75 55.76,16.41 CT.F2.0.2
F2.OUT  (via drill 0.35)
  Top 0.254: MUX.RF.OUT.7 20.8,21.41 20.8,20.69 21.17,20.32 41.66,20.32 v41.78,20.19
  Top 0.305: Z.F2.2.1 48.01,16.12 Z.F2.3.1 v45.21,17.27
  Bottom 0.254: v41.78,20.19 42.28,20.19 v45.21,17.27
F2.SCL  (via drill 0.35)
  Top 0.152: JP.F2.SCL0.1 58.55,11.53 JP.F2.SCL1.2 54.13,5.87 v53.34,5.08 | MUX.SCL.7 26.11,36.68 25.65,36.22 25.3,36.22 24.77,35.69 v24.77,35.43
  Bottom 0.152: v24.77,35.43 24.77,13.34 33.02,5.08 v53.34,5.08
F2.SDA  (via drill 0.35)
  Top 0.152: JP.F2.SDA1.2 54.51,9.27 v55.24,9.27 | v59.69,15.24 59.41,15.24 JP.F2.SDA0.1 | v24.13,36.83 16.51,36.83 14.68,38.66 MUX.SDA.7
  Bottom 0.152: v59.69,15.24 59.69,13.72 v55.24,9.27 55.24,6.13 53.59,4.47 33.2,4.47 24.38,13.29 24.38,34.96 24.16,35.18 24.16,36.8 v24.13,36.83
F2SCL0
  Top 0.152: JP.F2.SCL0.2 58.36,14.19 CT.F2.0.6
F2SCL1
  Top 0.152: JP.F2.SCL1.1 53.31,8.38 52.77,8.92 52.77,10.58 CT.F2.1.6
F2SDA0
  Top 0.152: JP.F2.SDA0.2 58.28,16.65 57.69,16.65 57.34,16.29 CT.F2.0.1
F2SDA1
  Top 0.152: JP.F2.SDA1.1 53.31,12.14 CT.F2.1.1
F3.IN
  Top 0.254: MUX.RF.IN.14 53.03,28.94 54.7,30.61 55.33,30.61 | 55.33,30.61 56.01,31.29 CT.F3.0.2 | 55.33,30.61 57.39,30.61 Z.F3.0.2
F3.OUT
  Top 0.254: Z.F\3.2.1 56.52,40.5 Z.F3.3.1 34.16,40.51 24.89,31.24 23.97,31.24 20.65,27.92 MUX.RF.OUT.14
F3.SCL  (via drill 0.35)
  Top 0.152: JP.F3.SCL0.1 51.46,34.09 v50.8,34.09 | v46.99,33.02 46.99,33.25 JP.F3.SCL1.2 46.09,34.15 45.62,34.15 43.94,35.83 v43.94,36.96 | v26.67,43.18 26.11,43.74 MUX.SCL.14
  Bottom 0.152: v46.99,33.02 48.06,34.09 v50.8,34.09 | v43.94,36.96 43.94,42.55 43.31,43.18 v26.67,43.18
F3.SDA  (via drill 0.35)
  Top 0.152: JP.F3.SDA0.1 51.03,31.75 JP.F3.SDA1.2 48.71,33.88 47.24,32.41 46.33,32.41 v44.58,34.16 | v18.67,46.61 16.77,46.61 16.32,46.16 16.25,46.23 15.1,46.23 14.68,45.81 MUX.SDA.14
  Bottom 0.152: v18.67,46.61 18.8,46.74 40.18,46.74 44.55,42.37 44.55,36.83 44.55,36.71 44.55,34.19 v44.58,34.16
F3SCL0
  Top 0.152: JP.F3.SCL0.2 54.76,34.29 CT.F3.0.6
F3SCL1
  Top 0.152: JP.F3.SCL1.1 47.62,34.7 48.16,35.24 50.08,35.24 CT.F3.1.6
F3SDA0
  Top 0.152: JP.F3.SDA0.2 55.19,31.75 CT.F3.0.1
F3SDA1
  Top 0.152: CT.F3.1.1 52.1,35.15 51.25,35.15 50.79,34.7 JP.F3.SDA1.1
GND  (via drill 0.25)
  Top 0.305: R4.1 R3.1 | C7.2 15.58,20.38 MUX.RF.OUT.1 | 19.33,21.59 MUX.RF.OUT.5 | 21.29,21.59 MUX.RF.OUT.8 | 19.33,27.23 MUX.RF.OUT.16 | SMA.OUT.2@1 SMA.OUT.2@3 | MUX.SDA.1 10.79,38.53 10.62,38.36 10.62,37.16 11.43,36.35 C11.2 11.55,36.27 13.11,36.27 14.05,37.21 MUX.SDA.6 MUX.SDA.5 | MUX.SDA.8 MUX.SDA.9
  other vias: 26.8,21.08 26.8,19.56 28.19,19.56 29.46,19.56 30.73,19.56 32,19.56 33.27,19.56 34.54,19.56 35.81,19.56 23.62,19.56 21.08,19.56 23.62,21.08 18.67,19.81 19.81,18.29 21.08,17.02 22.35,18.16 22.23,16.26 23.24,17.4 23.37,15.88 26.16,15.88 26.16,17.4 27.43,15.88 27.43,17.4 28.7,17.4 29.97,17.4 31.24,17.4 28.7,15.88 29.97,15.88 31.24,15.88 36.45,16.51 34.29,17.65 33.02,11.56 34.54,13.21 39.12,13.72 36.96,9.4 39.5,9.4 32.77,8.13 27.94,11.3 26.16,12.95 28.07,21.08 29.34,21.08 30.61,21.08 31.88,21.08 33.15,21.08 34.42,21.08 35.69,21.08 36.7,21.08 36.7,19.56 38.48,19.56 38.48,21.08 39.75,19.56 41.02,19.56 39.75,21.08 41.02,21.08 42.29,21.08 42.8,18.67 43.81,19.68 41.15,17.14 39.62,18.03 41.78,14.61 42.8,15.62 43.69,16.51 42.29,17.65 45.59,18.54 45.59,20.19 47.12,20.19 48.39,20.45 49.4,21.21 46.99,18.54 48.51,18.54 49.66,19.18 50.55,20.07 51.44,20.95 50.55,17.27 47.75,14.73 49.02,14.73 46.61,17.53 51.94,18.8 53.09,18.8 54.74,18.8 54.74,19.81 53.09,19.81 52.96,20.83 54.74,20.95 53.72,14.73 53.72,13.72 53.98,12.57 50.55,10.16 51.82,9.53 56.64,13.34 57.91,15.24 60.83,24.51 60.45,26.16 59.18,26.16 58.04,26.16 56.9,25.65 56.01,24.77 55.12,24 56.01,22.35 56.9,23.24 57.66,24 58.67,24.51 59.82,24.51 62.1,24 63.25,24.26 63.88,25.27 63.5,26.42 62.48,26.92 61.34,26.8 54.86,29.59 52.83,29.84 53.72,30.99 56.13,29.84 57.66,29.84 58.93,30.73 57.78,33.91 59.82,34.92 58.55,39.12 55.5,39.62 55.37,37.21 54.1,33.02 51.94,33.02 53.34,35.31 46.35,36.58 54.36,39.75 53.34,39.75 52.07,39.75 49.91,39.75 51.05,39.75 48.77,39.75 47.37,39.75 45.34,39.75 55.12,41.4 53.47,41.4 52.2,41.4 51.05,41.4 49.91,41.4 48.77,41.4 47.37,41.4 46.35,39.75 46.35,41.4 45.34,41.4 43.18,39.75 43.18,41.4 41.91,41.4 41.91,39.75 40.64,41.4 39.37,41.4 38.1,41.4 36.83,41.4 35.56,41.4 34.29,41.4 40.64,39.75 39.37,39.75 38.1,39.75 36.83,39.75 35.56,39.75 34.54,39.75 33.78,38.86 33.15,40.77 32.13,39.75 31.24,38.73 29.97,37.85 29.34,36.83 28.57,36.07 27.18,34.67 33.15,38.23 32.51,37.59 31.88,36.96 31.24,36.32 30.61,35.69 29.97,35.05 29.34,34.42 28.7,33.78 27.3,32.64 26.54,33.91 26.67,32 23.75,29.84 23.62,32.13 22.86,31.37 22.23,30.73 21.59,30.1 20.95,29.46 20.32,28.83 23.11,29.21 22.48,28.57 33.66,33.53 34.8,33.78 36.07,33.78 37.34,33.78 40.39,31.24 38.73,31.11 38.1,29.84 37.08,29.59 35.43,29.97 34.54,31.37 32.77,32.64 36.96,37.97 32.26,35.81 40.13,37.97 32.13,34.04 31.24,33.27 30.35,32.26 29.59,31.5 28.57,30.73 26.67,30.99 27.3,29.46 26.04,28.07 23.75,25.91 22.99,25.02 21.72,24.89 20.45,24.89 19.18,24.89 17.91,24.89 16.64,24.89 15.37,24.89 14.1,24.89 12.83,24.89 11.56,24.89 10.41,24.89 9.53,25.65 8.38,25.65 7.37,24.77 7.37,23.5 8.26,22.73 9.53,22.73 10.54,23.37 11.68,23.37 12.95,23.37 14.22,23.37 15.49,23.37 16.76,23.37 18.03,23.37 19.3,23.37 20.57,23.37 22.23,23.88 23.11,22.99 51.56,29.97 50.93,30.61 49.66,30.99 48.39,30.99 47.12,30.99 45.85,30.99 44.58,30.99 43.31,30.99 42.04,30.99 48.39,29.08 47.12,29.08 45.85,29.08 44.58,29.08 43.31,29.08 42.04,29.08 41.02,28.57 39.88,27.18 41.53,13.21 41.53,11.94 41.53,10.67 40.89,9.65 12.7,13.84 18.41,13.84 12.7,3.05 18.41,3.05 24.13,3.05 29.84,3.05 36.2,3.05 42.55,2.67 49.02,2.79 53.85,2.03 59.05,3.05 59.69,7.49 64.14,11.94 47.62,44.32 52.7,44.32 57.15,44.32 60.33,48.77 64.14,46.23 66.04,43.05 20.32,33.91 16.51,33.91 3.17,37.08 4.45,32.64 9.53,31.37 15.62,42.67 9.53,44.2 20.19,45.21 39.37,44.32 39.37,47.5 31.11,47.5 29.84,44.96 24.77,50.04 26.04,41.15 25.4,43.05 20.32,37.97 50.04,25.27 48.13,25.91 47.5,27.18 43.69,25.91 41.78,24 34.16,22.73 27.81,22.73 27.81,25.27 24.13,8.13 18.41,8.13 40.64,34.8 11.18,43.05 15.11,29.72 10.54,49.91 5.46,49.4 6.73,49.4
  pour Top: -1.91,-1.91 -1.91,60.33 71.75,60.33 71.75,-1.91
  pour Bottom: -3.17,-3.17 -3.17,61.59 74.3,61.59 74.3,-3.17
LDO.IN
  Top 0.305: JP.LDO.IN.1 7.17,44.99 U_LDO2.7.1 7.05,46 C13.1
LDO.OUT
  Top 0.305: U_LDO2.7.5 7.37,42.07 JP.LDO.OUT.2
MUX.A0  (via drill 0.35)
  Top 0.152: MUX.SDA.20 v10.79,43.94 9.37,42.52 9.37,34.59 MUX.RF.OUT.20 | v21.84,43.94 22.23,44.32 MUX.SCL.20 22.23,46.35 22.86,46.99 28.57,46.99 T.M0.TP | v43.05,49.53 43.05,49.15 56.56,49.15 63.55,42.16 63.55,33.53 56.51,26.49 49.89,26.49 49.15,27.24 MUX.RF.IN.20 | v34.29,49.53 34.03,49.27 32.76,49.27
  Top 0.305: T.M0.TP 29.96,48.38 R1.2 32.5,49.53 32.76,49.27 MUX0.A
  Bottom 0.152: v10.79,43.94 v21.84,43.94 | v43.05,49.53 v34.29,49.53
MUX.A1  (via drill 0.35)
  Top 0.152: MUX.SDA.19 11.68,44.98 11.68,44.41 12.45,43.64 v12.45,43.34 10.16,41.05 10.16,35.56 17.4,28.32 MUX.RF.OUT.19 | v22.99,43.81 22.86,43.94 MUX.SCL.19 23.11,45.49 23.11,46.07 23.25,46.2 30.89,46.2 32.52,44.57 33.52,44.57 33.65,44.7 33.65,46.59 MUX1.A | 42.79,46.99 43.3,47.5 57.4,47.5 62.99,41.91 62.99,33.66 56.13,26.8 50.12,26.8 49.78,27.13 MUX.RF.IN.19
  Top 0.305: MUX1.A 38.04,49.01 38.22,48.83 39.27,48.83 39.98,49.53 R2.1 42.79,46.99 T.M1.TP
  Bottom 0.152: v12.45,43.34 22.51,43.34 v22.99,43.81
N$6
  Top 0.305: MUX1.C R4.2
N$9
  Top 0.305: JP.LDO.EN.1 5.15,45.88 U_LDO2.7.3
N$10
  Top 0.305: MUX0.C R3.2
N$11
  Top 0.305: X1.13 29.68,50.23 36.07,50.23 36.78,49.53 R2.2
N$12
  Top 0.305: X1.11 25.49,52.5 R1.1
RF.F0.0
  Top 0.254: Z.F0.1.1 40.01,14.87 Z.F0.0.1 39.78,12.08 CT.F0.0.3 | Z.F0.1.1 39.23,14.86 CT.F0.1.2 | Z.F0.1.1 39.47,15.25 Z.F0.2.2
RF.F1.0
  Top 0.305: CT.F1.1.2 39,31.88 Z.F1.1.1 | Z.F1.1.1 37.45,34.7 Z.F1.2.2 | Z.F1.1.1 39.62,32.5 Z.F1.0.1 38.25,28.59 CT.F1.0.3
RF.F2.0
  Top 0.305: CT.F2.0.3 55.03,16.09 54.93,16.09 54.86,16.01 Z.F2.0.1 Z.F2.1.1 51.05,15.25 51.05,15.24 | 51.05,15.24 CT.F2.1.2 | 51.05,15.24 50.16,16.13 Z.F2.2.2
RF.F3.0
  Top 0.254: CT.F3.0.3 56.89,31.81 56.94,31.81 58.77,33.64 Z.F3.0.1 58.93,36.83 | 58.93,36.83 58.93,36.95 Z.F3.1.1 | 58.93,36.83 58.53,37.22 Z.F\3.2.2 55.77,37.97 CT.F3.1.2
RF_IN
  Top 0.305: MUX.RF.IN.10 57.81,25.4 SMA.IN.1
RF_OUT
  Top 0.254: MUX.RF.OUT.10 22.48,21.69 22.48,22.44 20.79,24.13 SMA.OUT.1
SCL  (via drill 0.35)
  Top 0.152: v23.24,47.88 23.24,47.8 21.24,45.8 21.24,43.69 21.59,43.34 21.59,43.18 22.55,42.22 27.39,42.22 27.69,42.52 28.19,42.52 28.55,42.16 28.55,41.66 28.07,41.18 MUX.SCL.10
  Top 0.305: R_SCL.1 v17.27,49.53 | v23.24,47.88 21.61,47.88 JP_SCL.2
  Bottom 0.305: v17.27,49.53 21.59,49.53 v23.24,47.88
SCL.IN
  Top 0.305: JP_SCL.1 21.09,48.67 X1.5
SDA  (via drill 0.35)
  Top 0.152: JP_SDA.1 19.05,47.09 19.28,46.86 19.28,46.36 19.05,46.13 v19.05,42.73 | v19.05,39.37 16.87,39.37 MUX.SDA.10
  Top 0.305: JP_SDA.1 16.85,47.85 R_SDA.1
  Bottom 0.152: v19.05,42.73 v19.05,39.37
SDA.IN
  Top 0.305: X1.3 17.01,50.21 17.55,50.21 17.95,49.81 17.95,49.76 JP_SDA.2

### Text on the board
tNames: Filter 3 | Filter 1 | Filter 2 | Filter 0 | Wired Wireless / Z-Matcher rev A / Reese Grimsley